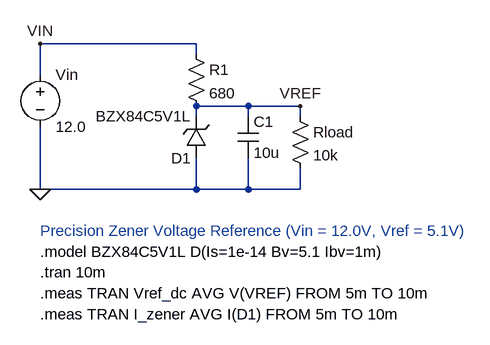
[diagram p0: schematic voltage_reference.asc]
voltage_reference.asc, the LTspice schematic file:
Version 4
SHEET 1 900 600
WIRE 80 128 80 176
WIRE 80 128 320 128
WIRE 80 256 80 352
WIRE 320 128 320 144
WIRE 320 224 400 224
WIRE 400 224 480 224
WIRE 320 224 320 240
WIRE 320 304 320 352
WIRE 400 224 400 240
WIRE 400 304 400 352
WIRE 480 224 480 240
WIRE 480 320 480 352
WIRE 80 352 480 352
FLAG 80 128 VIN
FLAG 480 224 VREF
FLAG 80 352 0
SYMBOL voltage 80 160 R0
SYMATTR InstName Vin
SYMATTR Value 12.0
SYMBOL res 304 128 R0
SYMATTR InstName R1
SYMATTR Value 680
SYMBOL zener 336 304 R180
SYMATTR InstName D1
SYMATTR Value BZX84C5V1L
SYMBOL cap 384 240 R0
SYMATTR InstName C1
SYMATTR Value 10u
SYMBOL res 464 224 R0
SYMATTR InstName Rload
SYMATTR Value 10k
TEXT 80 416 Left 2 ;Precision Zener Voltage Reference (Vin = 12.0V, Vref = 5.1V)
TEXT 80 448 Left 2 !.model BZX84C5V1L D(Is=1e-14 Bv=5.1 Ibv=1m)
TEXT 80 480 Left 2 !.tran 10m
TEXT 80 512 Left 2 !.meas TRAN Vref_dc AVG V(VREF) FROM 5m TO 10m
TEXT 80 544 Left 2 !.meas TRAN I_zener AVG I(D1) FROM 5m TO 10m

The netlist it stands for:
* voltage_reference.asc
Vin VIN 0 12.0
R1 VIN VREF 680
D1 0 VREF BZX84C5V1L
C1 VREF 0 10u
Rload VREF 0 10k
.model D D
.lib standard.dio
* Precision Zener Voltage Reference (Vin = 12.0V, Vref = 5.1V)
.model BZX84C5V1L D(Is=1e-14 Bv=5.1 Ibv=1m)
.tran 10m
.meas TRAN Vref_dc AVG V(VREF) FROM 5m TO 10m
.meas TRAN I_zener AVG I(D1) FROM 5m TO 10m
.backanno
.end